# Altium schematic sheet main.SchDoc: Main Sheet
size A4; SheetNumber: 1; SheetTotal: 6
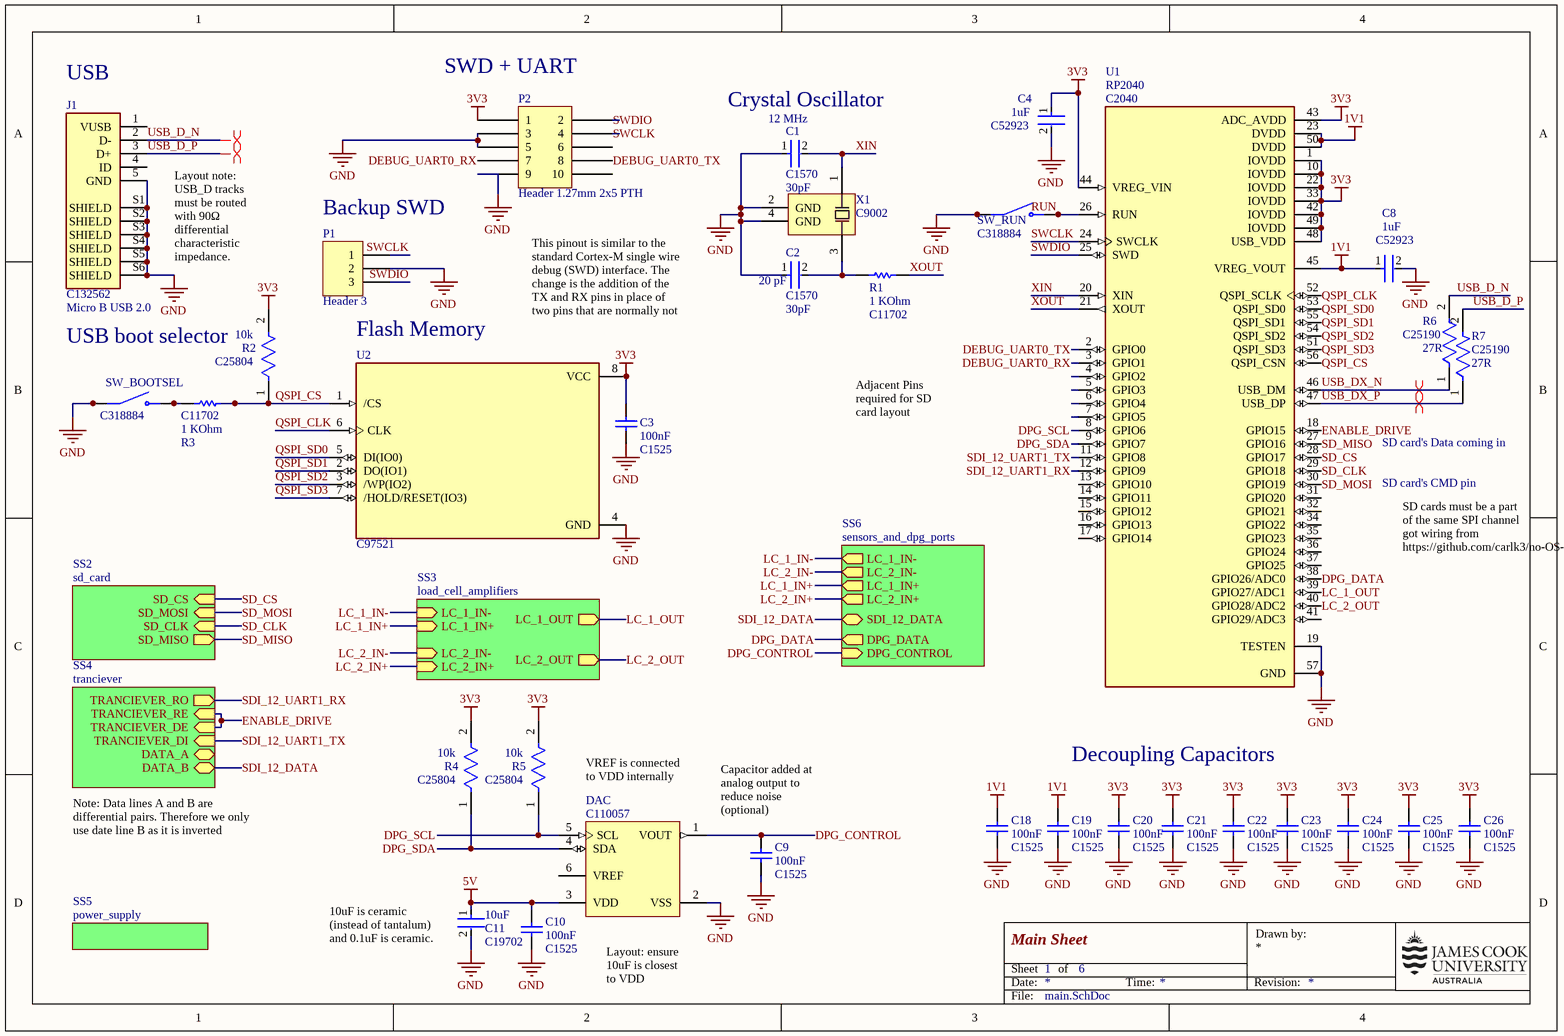
[diagram p0: main.SchDoc]

## Parts
C1  JLCPCB Part: C1570  Capacitance: 30pF  [FP-0402-L_1_0_1-W_0_5_0_1-IPC_B]  (hidden comment: 0402CG300J500NT)
C2  JLCPCB Part: C1570  Capacitance: 30pF  [FP-0402-L_1_0_1-W_0_5_0_1-IPC_B]  (hidden comment: 0402CG300J500NT)
C3  JLCPCB Part: C1525  Capacitance: 100nF  [CAPC1050X55X23NL05T13]  (hidden comment: CL05B104KO5NNNC)
C4  Capacitance: 1uF  JLCPCB Part: C52923  [FP-CL542-IPC_B]  (hidden comment: CL05A105KA5NQNC)
C8  Capacitance: 1uF  JLCPCB Part: C52923  [FP-CL542-IPC_B]  (hidden comment: CL05A105KA5NQNC)
C9  JLCPCB Part: C1525  Capacitance: 100nF  [CAPC1050X55X23NL05T13]  (hidden comment: CL05B104KO5NNNC)
C10  JLCPCB Part: C1525  Capacitance: 100nF  [CAPC1050X55X23NL05T13]  (hidden comment: CL05B104KO5NNNC)
C11  JLCPCB Part: C19702  Capacitance: 10uF  [FP-CL10-IPC_B]  (hidden comment: CL10A106KP8NNNC)
C18  JLCPCB Part: C1525  Capacitance: 100nF  [CAPC1050X55X23NL05T13]  (hidden comment: CL05B104KO5NNNC)
C19  JLCPCB Part: C1525  Capacitance: 100nF  [CAPC1050X55X23NL05T13]  (hidden comment: CL05B104KO5NNNC)
C20  JLCPCB Part: C1525  Capacitance: 100nF  [CAPC1050X55X23NL05T13]  (hidden comment: CL05B104KO5NNNC)
C21  JLCPCB Part: C1525  Capacitance: 100nF  [CAPC1050X55X23NL05T13]  (hidden comment: CL05B104KO5NNNC)
C22  JLCPCB Part: C1525  Capacitance: 100nF  [CAPC1050X55X23NL05T13]  (hidden comment: CL05B104KO5NNNC)
C23  JLCPCB Part: C1525  Capacitance: 100nF  [CAPC1050X55X23NL05T13]  (hidden comment: CL05B104KO5NNNC)
C24  JLCPCB Part: C1525  Capacitance: 100nF  [CAPC1050X55X23NL05T13]  (hidden comment: CL05B104KO5NNNC)
C25  JLCPCB Part: C1525  Capacitance: 100nF  [CAPC1050X55X23NL05T13]  (hidden comment: CL05B104KO5NNNC)
C26  JLCPCB Part: C1525  Capacitance: 100nF  [CAPC1050X55X23NL05T13]  (hidden comment: CL05B104KO5NNNC)
DAC  JLCPCB Part: C110057  [SOT-23-CH6_M]  (hidden comment: MCP4716A0T-E/CH)
J1  Micro B USB 2.0  JLCPCB Part: C132562  [FCI_10118193-0001LF]
P1  Header 3  [HDR1X3]
P2  Header 1.27mm 2x5 PTH  [Header 1.27mm 2x5 PTH]
R1  JLCPCB Part: C11702  Resistance: 1 KOhm  [RESC1005X40X25NL05T05]  (hidden comment: 0402WGF1001TCE)
R2  JLCPCB Part: C25804  Resistance: 10k  [FP-CRCW0603-e3-IPC_B]  (hidden comment: 0603WAF1002T5E)
R3  JLCPCB Part: C11702  Resistance: 1 KOhm  [RESC1005X40X25NL05T05]  (hidden comment: 0402WGF1001TCE)
R4  JLCPCB Part: C25804  Resistance: 10k  [FP-CRCW0603-e3-IPC_B]  (hidden comment: 0603WAF1002T5E)
R5  JLCPCB Part: C25804  Resistance: 10k  [FP-CRCW0603-e3-IPC_B]  (hidden comment: 0603WAF1002T5E)
R6  JLCPCB Part: C25190  Resistance: 27R  [FP-CRCW0603-e3-IPC_B]  (hidden comment: 0603WAF270JT5E)
R7  JLCPCB Part: C25190  Resistance: 27R  [FP-CRCW0603-e3-IPC_B]  (hidden comment: 0603WAF270JT5E)
SW_BOOTSEL  JLCPCB Part: C318884  [SW_TS-1187A-B-A-B]  (hidden comment: TS-1187A-B-A-B)
SW_RUN  JLCPCB Part: C318884  [SW_TS-1187A-B-A-B]  (hidden comment: TS-1187A-B-A-B)
U1  RP2040  JLCPCB Part: C2040  [QFN40P700X700X90-57N]
U2  JLCPCB Part: C97521  [SOIC127P790X216-8N]  (hidden comment: W25Q128JVSIQ)
X1  Frequency: 12 MHz  JLCPCB Part: C9002  Load capacitance: 20 pF  [X322512MSB4SI-Footprint-1]  (hidden comment: X322512MSB4SI)

## Sub-sheets
SS2 = sd_card: SD_CS (in), SD_CLK (in), SD_MOSI (in), SD_MISO (out)
SS3 = load_cell_amplifiers: LC_1_IN- (in), LC_1_IN+ (in), LC_1_OUT (out), LC_2_IN- (in), LC_2_IN+ (in), LC_2_OUT (out)
SS4 = tranciever: TRANCIEVER_RO (out), TRANCIEVER_RE (in), TRANCIEVER_DE (in), TRANCIEVER_DI (in), DATA_A (bidir), DATA_B (bidir)
SS5 = power_supply: no entries
SS6 = sensors_and_dpg_ports: LC_1_IN- (out), LC_2_IN- (out), LC_2_IN+ (out), LC_1_IN+ (out), SDI_12_DATA (bidir), DPG_CONTROL (in), DPG_DATA (out)

## Nets
1V1: C8.1 C18.2 C19.2 U1.23(DVDD) U1.45(VREG_VOUT) U1.50(DVDD)
3V3: C3.2 C4.1 C20.2 C21.2 C22.2 C23.2 C24.2 C25.2 C26.2 P2.1 R2.2 R4.2 R5.2 U1.1(IOVDD) U1.10(IOVDD) U1.22(IOVDD) U1.33(IOVDD) U1.42(IOVDD) U1.43(ADC_AVDD) U1.44(VREG_VIN) U1.48(USB_VDD) U1.49(IOVDD) U2.8(VCC)
5V: C10.2 C11.1 DAC.3(VDD)
GND: C1.1 C2.1 C3.1 C4.2 C8.2 C9.1 C10.1 C11.2 C18.1 C19.1 C20.1 C21.1 C22.1 C23.1 C24.1 C25.1 C26.1 DAC.2(VSS) J1.5(GND) J1.S1(SHIELD) J1.S2(SHIELD) J1.S3(SHIELD) J1.S4(SHIELD) J1.S5(SHIELD) J1.S6(SHIELD) P1.2 P2.3 P2.5 P2.9 SW_BOOTSEL.A(COM) SW_BOOTSEL.B(COM) SW_RUN.A(COM) SW_RUN.B(COM) U1.19(TESTEN) U1.57(GND) U2.4(GND) X1.2(GND) X1.4(GND)
DEBUG_UART0_RX: P2.7 U1.3(GPIO1)
DEBUG_UART0_TX: P2.8 U1.2(GPIO0)
DPG_CONTROL: C9.2 DAC.1(VOUT) ; sheet SS6/DPG_CONTROL
DPG_DATA: U1.38(GPIO26/ADC0) ; sheet SS6/DPG_DATA
DPG_SCL: DAC.5(SCL) R5.1 U1.8(GPIO6)
DPG_SDA: DAC.4(SDA) R4.1 U1.9(GPIO7)
ENABLE_DRIVE: U1.18(GPIO15) ; sheet SS4/TRANCIEVER_RE, sheet SS4/TRANCIEVER_DE
LC_1_IN+: sheet SS3/LC_1_IN+, sheet SS6/LC_1_IN+
LC_1_IN-: sheet SS3/LC_1_IN-, sheet SS6/LC_1_IN-
LC_1_OUT: U1.39(GPIO27/ADC1) ; sheet SS3/LC_1_OUT
LC_2_IN+: sheet SS3/LC_2_IN+, sheet SS6/LC_2_IN+
LC_2_IN-: sheet SS3/LC_2_IN-, sheet SS6/LC_2_IN-
LC_2_OUT: U1.40(GPIO28/ADC2) ; sheet SS3/LC_2_OUT
QSPI_CLK: U1.52(QSPI_SCLK) U2.6(CLK)
QSPI_CS: R2.1 R3.2 U1.56(QSPI_CSN) U2.1(/CS)
QSPI_SD0: U1.53(QSPI_SD0) U2.5(DI(IO0))
QSPI_SD1: U1.55(QSPI_SD1) U2.2(DO(IO1))
QSPI_SD2: U1.54(QSPI_SD2) U2.3(/WP(IO2))
QSPI_SD3: U1.51(QSPI_SD3) U2.7(/HOLD/RESET(IO3))
RUN: SW_RUN.C(NO) SW_RUN.D(NO) U1.26(RUN)
SD_CLK: U1.29(GPIO18) ; sheet SS2/SD_CLK
SD_CS: U1.28(GPIO17) ; sheet SS2/SD_CS
SD_MISO: U1.27(GPIO16) ; sheet SS2/SD_MISO
SD_MOSI: U1.30(GPIO19) ; sheet SS2/SD_MOSI
SDI_12_DATA: sheet SS4/DATA_B, sheet SS6/SDI_12_DATA
SDI_12_UART1_RX: U1.12(GPIO9) ; sheet SS4/TRANCIEVER_RO
SDI_12_UART1_TX: U1.11(GPIO8) ; sheet SS4/TRANCIEVER_DI
SWCLK: P1.1 P2.4 U1.24(SWCLK)
SWDIO: P1.3 P2.2 U1.25(SWD)
USB_D_N: J1.2(D-) R6.2
USB_D_P: J1.3(D+) R7.2
USB_DX_N: R6.1 U1.46(USB_DM)
USB_DX_P: R7.1 U1.47(USB_DP)
XIN: C1.2 U1.20(XIN) X1.1(OSC1)
XOUT: R1.2 U1.21(XOUT)
NetC2_2: C2.2 R1.1 X1.3(OSC2)
NetR3_1: R3.1 SW_BOOTSEL.C(NO) SW_BOOTSEL.D(NO)

Not connected (* = marked no-connect by the designer): DAC 6(VREF); J1 1(VUSB) 4(ID); P2 6 10; U1 4(GPIO2) 5(GPIO3) 6(GPIO4) 7(GPIO5) 13(GPIO10) 14(GPIO11) 15(GPIO12) 16(GPIO13) 17(GPIO14) 31(GPIO20) 32(GPIO21) 34(GPIO22) 35(GPIO23) 36(GPIO24) 37(GPIO25) 41(GPIO29/ADC3)

## Layout directives
differential pair: USB_D_N, USB_D_P, USB_DX_N, USB_DX_P

## Notes on the sheet
- (near J1) USB
- (near P2) SWD + UART
- (near C1) Crystal Oscillator
- (near P1) Backup SWD
- Layout note: USB_D tracks must be routed with 90Ω differential characteristic impedance.
- This pinout is similar to the standard Cortex-M single wire debug (SWD) interface. The change is the addition of the TX and RX pins in place of two pins that are normally not connected.
- (near R2) USB boot selector
- Flash Memory
- Adjacent Pins required for SD card layout
- SD card's Data coming in
- SD card's CMD pin
- SD cards must be a part of the same SPI channel
  got wiring from https://github.com/carlk3/no-OS-FatFS-SD-SPI-RPi-Pico
- VREF is connected to VDD internally
- Decoupling Capacitors
- Note: Data lines A and B are differential pairs. Therefore we only use date line B as it is inverted
- Capacitor added at analog output to reduce noise (optional)
- (near C11) 10uF is ceramic (instead of tantalum) and 0.1uF is ceramic.
- (near DAC) Layout: ensure 10uF is closest to VDD
- Date:
- Sheet
- of
- Time:
- Revision:
- Drawn by:
- File:

## Library data of the parts
C1 C2 = CMP-006-0002-1: General Purpose Ceramic Capacitor, 0402, 30pF, 5%, C0G, 30ppm/°C, 50V; Insulation Resistance: 100GR; Height: 0.5mm; Dielectric: C0G; Max Operating Temperature: 125°C; Contact Plating: Tin; Thickness: 0.022inch; Lead Free: Lead Free; Case Code (Metric): 1005; Min Operating Temperature: -55°C; Termination: SMD/SMT; Number of Pins: 2; REACH SVHC: No SVHC; Length: 1mm; Tolerance: 5%; Depth: 0.5mm; Voltage: 50V; Width: 0.5mm; Radiation Hardening: No; Voltage Rating: 50V; Case Code (Imperial): 0402; Package Quantity: 1; Construction: Flat; Case/Package: 0402; Temperature Coefficient: 30ppm/°C; Mount: Surface Mount; Packaging: Tape and Reel; RoHS Compliant: Yes; Voltage Rating (DC): 50V; Series: -
C3 C9 C10 C18-C26 = CMP-00007-3: Chip Capacitor, 100 nF, +/- 10%, 16 V, -55 to 125 degC, 0402 (1005 Metric), RoHS, Tape and Reel; Manufacturer: Samsung Electro-Mechanics; Rated Voltage: 16V; Dielectric: X7R; Manufacturer URL: http://www.samsungsem.com/global/index.jsp; Datasheet Version: Nov-10; Case Size/Dimension: 0402; Tolerance (%): ±10%; Datasheet URL: https://datasheet.ciiva.com/29198/458718-da-01-en-vs-kondensator-0402-29198423.pdf
C4 C8 = CMP-00005-3: Cap Ceramic 1uF 25V X5R ±10% SMD 0402 +85°C Paper T/R; Height: 0.5mm; Thickness: 0.022inch; Radiation Hardening: No; Dielectric: X5R; Lead Free: Lead Free; Min Operating Temperature: -55°C; Mount: Surface Mount; Package Quantity: 10000; Case Code (Imperial): 0402; Voltage Rating: 25V; Case Code (Metric): 1005; Length: 1mm; Max Operating Temperature: 85°C; Case/Package: 0402; Tolerance: 10%; Packaging: Tape and Reel; Material: Ceramic; Depth: 0.5mm; Width: 0.02inch
C11 = CMP-00006-4: Cap Ceramic 10uF 10V X5R ±10% Pad SMD 0603 +85°C T/R; Case Code (Metric): 1608; Packaging: Tape and Reel; Case/Package: 0603; Voltage Rating: 10V; Mount: Surface Mount; Max Operating Temperature: 85°C; Width: 0.031inch; Length: 0.063inch; Case Code (Imperial): 0603; Thickness: 0.041inch; Tolerance: 10%; Min Operating Temperature: -55°C
DAC = CMP-0188-01210-1: 10-Bit Voltage Output Digital-to-Analog Converter with EEPROM and I2C Interface, 6-Pin SOT-23, Extended Temperature, Tape and Reel; Code_IPC: SOT26A-6; ComponentLink2Description: Datasheet; DatasheetVersion: revB, Sep-2011; PackageDescription: 6-Lead Plastic Small Outline Transistor (CH) [SOT-23]; ComponentLink2URL: http://ww1.microchip.com/downloads/en/DeviceDoc/22272B.pdf; ComponentLink1URL: http://www.microchip.com/; PackageReference: SOT-23-CH6; ComponentLink1Description: Manufacturer URL; ComponentLink3URL: http://www.microchip.com/stellent/groups/techpub_sg/documents/packagingspec/en012702.pdf; ComponentLink3Description: Package Specification; PackageVersion: revBB, Aug-2009
J1 = CMP-045-000000-8: USB - micro B USB 2.0 Receptacle Connector 5 Position Surface Mount, Right Angle; Through Hole; MF: Amphenol ICC; MP: 10118193-0001LF; Component Type: Standard; Design Item ID: 10118193-0001LF; Pin Count: 11; Package: None; Source: SnapEDAsch.SchLib; SnapEDA_Link: https://www.snapeda.com/parts/10118193-0001LF/Amphenol%20FCI/view-part/2758989/?ref=snap
P1 = CMP-002-00117-1: Header, 3-Pin; Signal Integrity: Connector; Design Item ID: Header 3; LatestRevisionDate: 17-Jul-2002; Publisher: Altium Limited; Component Type: Standard; Pin Count: 3; Source: Miscellaneous Connectors.SchLib; LatestRevisionNote: Re-released for DXP Platform.
P2 = CMP-005-0002-2: Header 1.27mm pitch, 2x5, PTH through hole; Pins: 10; element14 Item: 1577743; Design Item ID: Header 1.27mm 2x5 PTH; Source: JCULibrary.SchLib; Component Type: Standard
R1 R3 = CMP-009-0000-2: Chip Resistor, 1 KOhm, +/- 1%, 100 mW, -55 to 155 degC, 0402 (1005 Metric), RoHS, Tape and Reel; Manufacturer: Basic Passives; Voltage Rating: 50 V; Case\/Package: 0402; Power Rating: 100 mW; PackageDescription: 2-Pin Surface Mount Device, Body 1 x 0.5 mm; Max Operating Temperature: 155 degC; PackageReference: 0402; Mount: Surface Mount; Package Quantity: 10000; Pins: 2; Mounting Technology: Surface Mount; Tolerance: 1%; Width: 0.5 mm; Min Operating Temperature: -55 degC; Height: 0.35 mm; Packaging: Tape and Reel; Case Code (Metric): 1005; Case Code (Imperial): 0402; Radiation Hardening: No; PartNumber: 0402WGF1001TCE; Length: 1 mm; REACH SVHC: Yes; RoHSCompliant: true
R2 R4 R5 = CMP-009-0009-1: RES Thick Film, 10kΩ, 1%, 0.1W, 100ppm/°C, 0603; Voltage Rating: 75V; Power Rating: 100mW; Composition: Thick Film; Military Standard: Not; Temperature Coefficient: 100ppm/°C; Length: 1.55mm; Tolerance: 1%; Lead Free: Lead Free; Max Operating Temperature: 155°C; Number of Pins: 2; Width: 0.85mm; Termination: SMD/SMT; Packaging: Tape and Reel; Weight: 7.1E-05oz; Radiation Hardening: No; Voltage Rating (DC): 75V; Height: 0.45mm; Min Operating Temperature: -55°C; Mount: Surface Mount; Contact Plating: Tin; Case Code (Metric): 1608; Case Code (Imperial): 0603; Depth: 0.85mm; Case/Package: 0603; Package Quantity: 5000
R6 R7 = CMP-00004-5: RES Thick Film, 27Ω, 1%, 0.1W, 200ppm/°C, 0603; Voltage Rating (DC): 75V; Temperature Coefficient: 100ppm/°C; Power Rating: 100mW; Height: 0.45mm; Contact Plating: Tin; Radiation Hardening: No; Case/Package: 0603; Mount: Surface Mount; Max Operating Temperature: 155°C; Packaging: Tape and Reel; Length: 1.55mm; Tolerance: 1%; Package Quantity: 5000; Termination: SMD/SMT; Number of Pins: 2; Depth: 0.85mm; Case Code (Metric): 1608; Case Code (Imperial): 0603; Width: 0.85mm; Military Standard: Not; Min Operating Temperature: -55°C; Lead Free: Lead Free; Composition: Thick Film; Weight: 7.1E-05oz; Voltage Rating: 75V
SW_BOOTSEL SW_RUN = CMP-051-000000-5: SPST 50mA @ 12VDC Top Actuated Round Button 160gf SMD Tactile Switches RoHS; Value: *; Pin Count: 4; MP: TS-1187A-B-A-B; Price: None; Availability: Unavailable; Design Item ID: TS-1187A-B-A-B; Package: None; Component Type: Standard; Source: TS-1187A-B-A-B.SchLib
U1 = CMP-043-000000-5: ARM Cortex-M0+ MCU 32-Bit Microcontroller for Raspberry Pi Pico; Package: None; Price: None; Availability: Available; Design Item ID: RP2040; Component Type: Standard; Pin Count: 57; Source: RP2040.SchLib; Value: *; MP: RP2040
U2 = CMP-031-00006-4: FLASH - NOR Memory IC 128Mb (16M x 8) SPI - Quad I/O, QPI, DTR 133 MHz 8-SOIC; MF: Winbond Electronics; Pin Count: 8; Check_prices: https://www.snapeda.com/parts/W25Q128JVSIQ/Winbond+Electronics/view-part/?ref=eda; Package: SOIC-8 Winbond; MP: W25Q128JVSIQ; Component Type: Standard; Source: W25Q128JVSIQ.SchLib; Design Item ID: W25Q128JVSIQ; Purchase-URL: https://pricing.snapeda.com/search/part/W25Q128JVSIQ/?ref=eda; Price: None; Availability: In Stock; SnapEDA_Link: https://www.snapeda.com/parts/W25Q128JVSIQ/Winbond+Electronics/view-part/?ref=snap; Value: *
X1 = CMP-00002-4: 12MHz SMD Crystal Resonator 20pF ±10ppm ±30ppm -40℃~+85℃ SMD3225-4P  Crystals ROHS Yangxing Tech; Max ESR: 80 Ω